# Altium schematic sheet I2C_ISO.SchDoc
size 420 x 297 mm; SheetNumber: 18; SheetTotal: 19
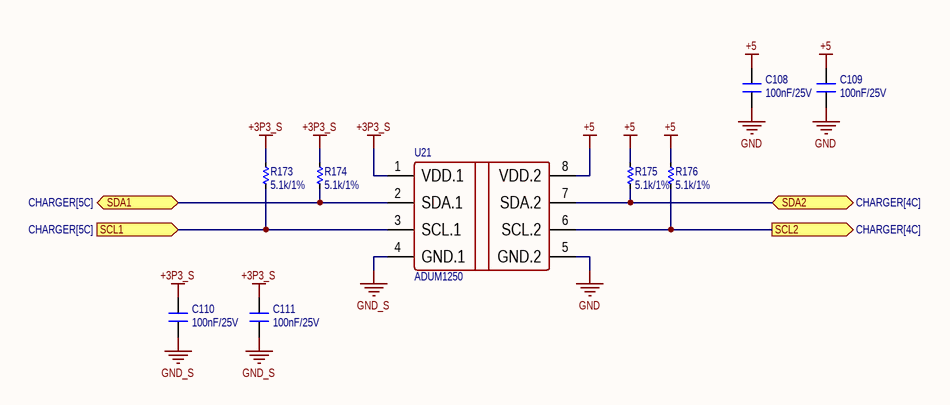
[diagram p0: I2C_ISO.SchDoc]

## Parts
C108  100nF/25V  [CN-SMD-0603]
C109  100nF/25V  [CN-SMD-0603]
C110  100nF/25V  [CN-SMD-0603]
C111  100nF/25V  [CN-SMD-0603]
R173  5.1k/1%  [RES-SMD-0603]
R174  5.1k/1%  [RES-SMD-0603]
R175  5.1k/1%  [RES-SMD-0603]
R176  5.1k/1%  [RES-SMD-0603]
U21  ADUM1250  [SO8]

## Ports
SCL1 (in, see CHARGER[5C]), SCL2 (out, see CHARGER[4C]), SDA1 (bidir, see CHARGER[5C]), SDA2 (bidir, see CHARGER[4C])

## Nets
+3P3_S: C110.1 C111.1 R173.1 R174.1 U21.1(VDD.1)
+5: C108.1 C109.1 R175.1 R176.1 U21.8(VDD.2)
GND: C108.2 C109.2 U21.5(GND.2)
GND_S: C110.2 C111.2 U21.4(GND.1)
SCL1: R173.2 U21.3(SCL.1) ; port SCL1
SCL2: R176.2 U21.6(SCL.2) ; port SCL2
SDA1: R174.2 U21.2(SDA.1) ; port SDA1
SDA2: R175.2 U21.7(SDA.2) ; port SDA2

## Notes on the sheet
- Project:
- Sub-system:
- Design by:
- Sheet title:
- Sheet
- of
- Checked by:
- Approved by:
- Document No:
- Revision:
- Size:
- Date:

## Library data of the parts
C108-C111 = CN: CAP CER 0.1UF 25V X7R 0603; PN: CL10B104KA8NNNC
R173-R176 = Res-SMD: RES SMD 5.1K OHM 1% 1/10W 0603; Manufacturer: Generic Components; PN: ERJ-3EKF5101V; Class: Passive; Publisher: Altium Hobart Technology Centre
U21 = ADUM1250: DGTL ISOLTR 2.5KV 2CH I2C 8-SOIC; PN: ADUM1250ARZ-RL7